# EAGLE schematic IceCore (EAGLE 7.7.0)
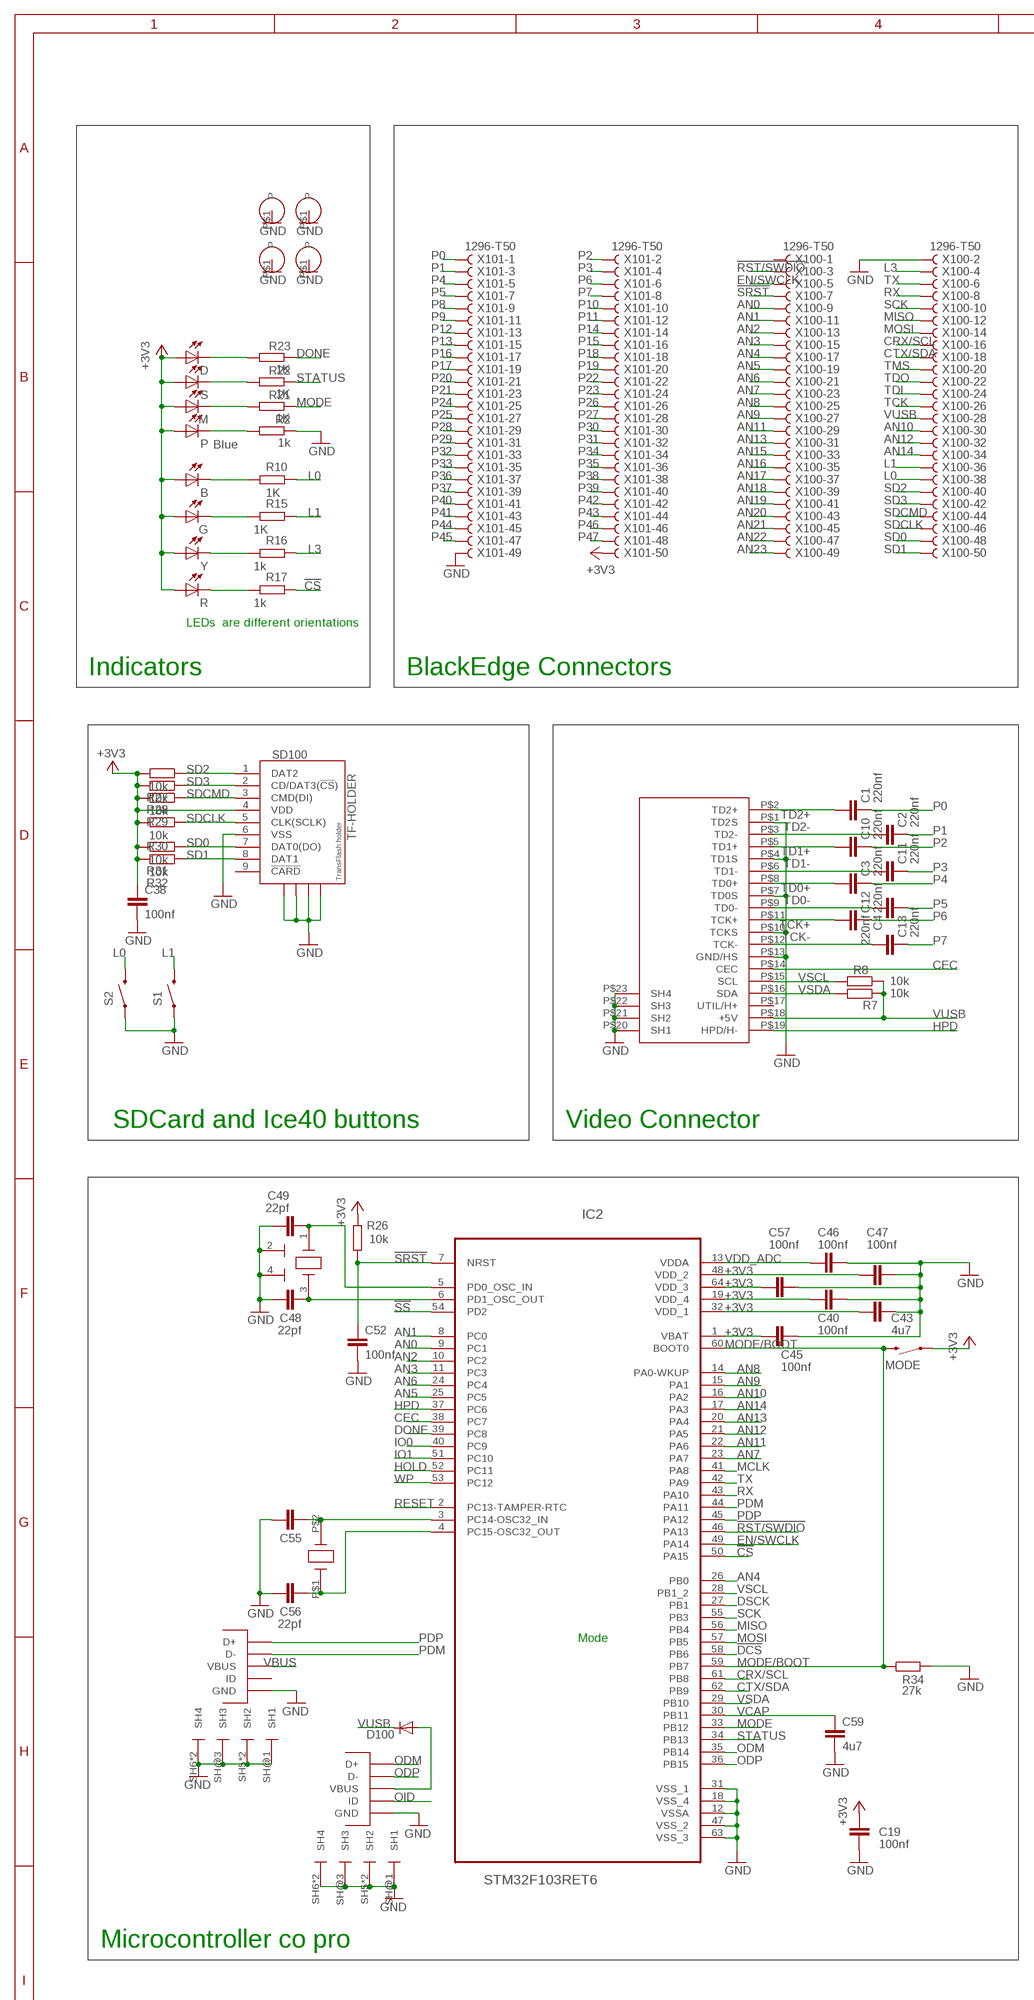
[diagram p0: schematic, sheet 1, part 1 of 2]
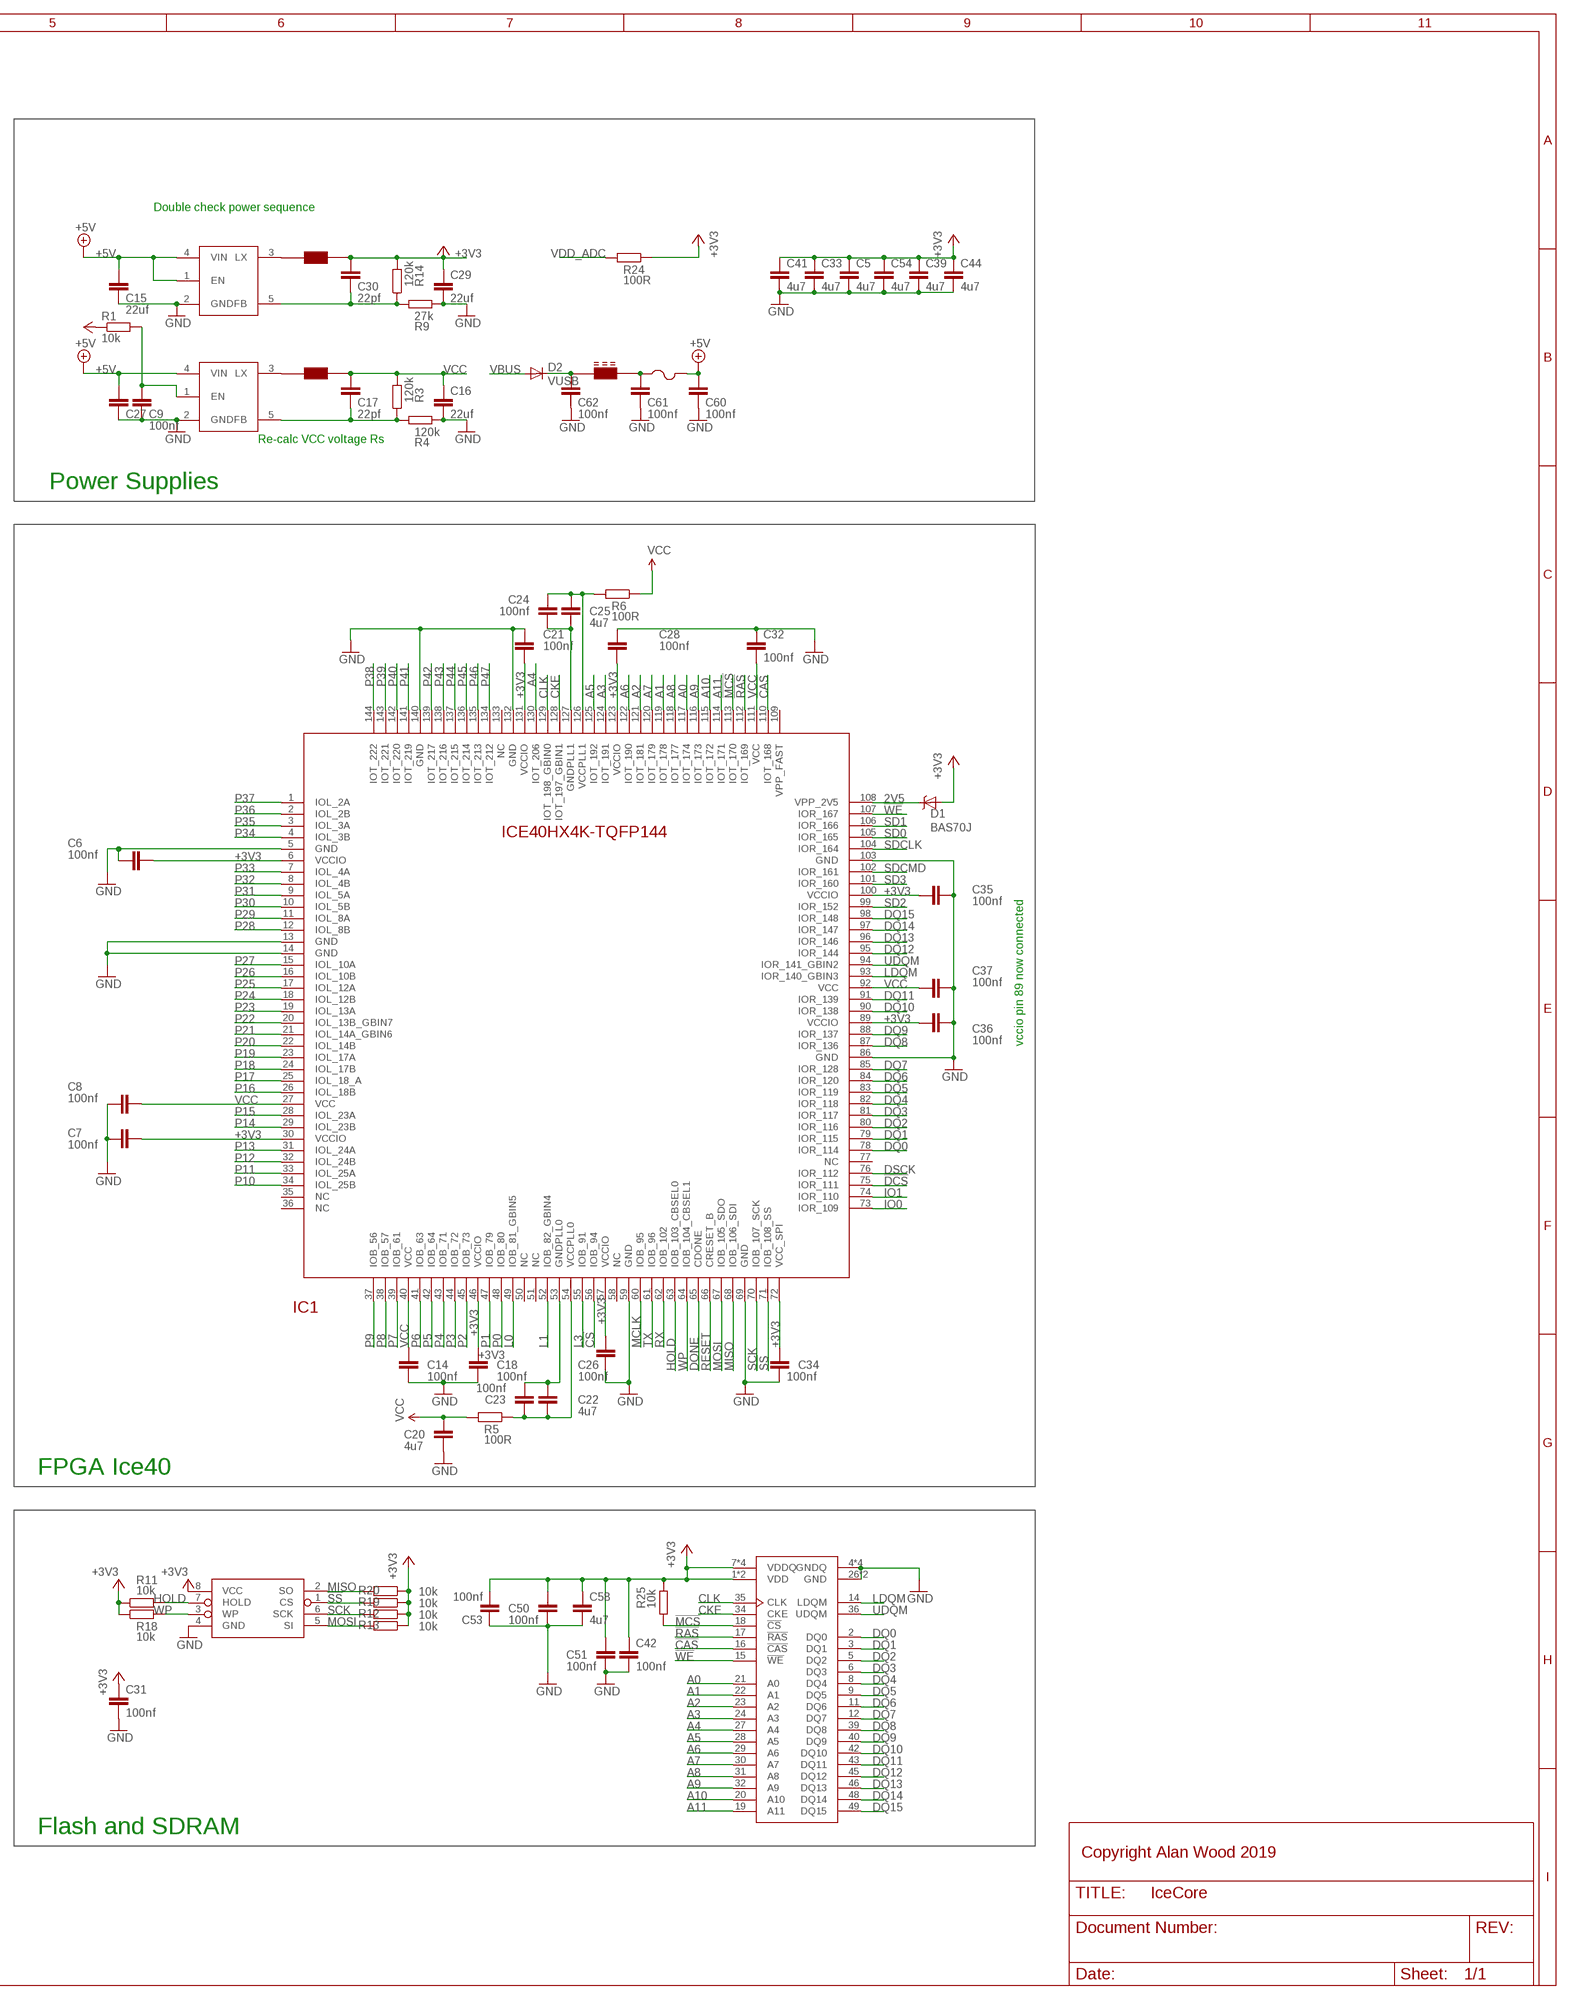
[diagram p1: schematic, sheet 1, part 2 of 2]

## Parts
B  LEDCHIPLED_0603  [CHIPLED_0603]
C1  220nf  C-EUC0402  [C0402]
C2  220nf  C-EUC0402  [C0402]
C3  220nf  C-EUC0402  [C0402]
C4  220nf  C-EUC0402  [C0402]
C5  4u7  C-EUC0402  [C0402]
C6  100nf  C-EUC0402  [C0402]
C7  100nf  C-EUC0402  [C0402]
C8  100nf  C-EUC0402  [C0402]
C9  100nf  C-EUC0402  [C0402]
C10  220nf  C-EUC0402  [C0402]
C11  220nf  C-EUC0402  [C0402]
C12  220nf  C-EUC0402  [C0402]
C13  220nf  C-EUC0402  [C0402]
C14  100nf  C-EUC0402  [C0402]
C15  22uf  C-EUC0603  [C0603]
C16  22uf  C-EUC0603  [C0603]
C17  22pf  C-EUC0402  [C0402]
C18  100nf  C-EUC0402  [C0402]
C19  100nf  C-EUC0402  [C0402]
C20  4u7  C-EUC0402  [C0402]
C21  100nf  C-EUC0402  [C0402]
C22  4u7  C-EUC0402  [C0402]
C23  100nf  C-EUC0402  [C0402]
C24  100nf  C-EUC0402  [C0402]
C25  4u7  C-EUC0402  [C0402]
C26  100nf  C-EUC0402  [C0402]
C27  22uf  C-EUC0603  [C0603]
C28  100nf  C-EUC0402  [C0402]
C29  22uf  C-EUC0603  [C0603]
C30  22pf  C-EUC0402  [C0402]
C31  100nf  C-EUC0402  [C0402]
C32  100nf  C-EUC0402  [C0402]
C33  4u7  C-EUC0402  [C0402]
C34  100nf  C-EUC0402  [C0402]
C35  100nf  C-EUC0402  [C0402]
C36  100nf  C-EUC0402  [C0402]
C37  100nf  C-EUC0402  [C0402]
C38  100nf  C-EUC0402  [C0402]
C39  4u7  C-EUC0402  [C0402]
C40  100nf  C-EUC0402  [C0402]
C41  4u7  C-EUC0402  [C0402]
C42  100nf  C-EUC0402  [C0402]
C43  4u7  C-EUC0402  [C0402]
C44  4u7  C-EUC0402  [C0402]
C45  100nf  C-EUC0402  [C0402]
C46  100nf  C-EUC0402  [C0402]
C47  100nf  C-EUC0402  [C0402]
C48  22pf  C-EUC0402  [C0402]
C49  22pf  C-EUC0402  [C0402]
C50  100nf  C-EUC0402  [C0402]
C51  100nf  C-EUC0402  [C0402]
C52  100nf  C-EUC0402  [C0402]
C53  100nf  C-EUC0402  [C0402]
C54  4u7  C-EUC0402  [C0402]
C55  22pf  C-EUC0402  [C0402]
C56  22pf  C-EUC0402  [C0402]
C57  100nf  C-EUC0402  [C0402]
C58  4u7  C-EUC0402  [C0402]
C59  4u7  C-EUC0402  [C0402]
C60  100nf  C-EUC0402  [C0402]
C61  100nf  C-EUC0402  [C0402]
C62  100nf  C-EUC0402  [C0402]
COM  FCI-MICROUSB-B-PEG  [MICROUSB-B-PEG]
D  LEDCHIPLED_0603  [CHIPLED_0603]
D1  BAS70J  [SOD-323]
D2  DIODE-SOD123  [SOD123]
D100  DIODE-SOD123  [SOD123]
F1  PTCFUSE-1206  [R1206]
FB1  FERRITE_BEAD  [0603]
G  LEDCHIPLED_0603  [CHIPLED_0603]
IC1  ICE40HX4K_TQFP144  [TQFP144]
IC2  STM32F103RET6  [QFP50P1200X1200X160-64N]
IC3  SDRAM  [TSOP-2-50]
M  LEDCHIPLED_0603  [CHIPLED_0603]
MODE  SWITCH-MOMENTARY-2SMD-1101NE  [TACTILE-SWITCH-1101NE]
P  Blue  LEDCHIPLED_0603  [CHIPLED_0603]
R  LEDCHIPLED_0603  [CHIPLED_0603]
R1  10k  R-EU_R0402  [R0402]
R2  1k  R-EU_R0402  [R0402]
R3  120k  R-EU_R0402  [R0402]
R4  120k  R-EU_R0402  [R0402]
R5  100R  R-EU_R0402  [R0402]
R6  100R  R-EU_R0402  [R0402]
R7  10k  R-EU_R0402  [R0402]
R8  10k  R-EU_R0402  [R0402]
R9  27k  R-EU_R0402  [R0402]
R10  1K  R-EU_R0402  [R0402]
R11  10k  R-EU_R0402  [R0402]
R12  10k  R-EU_R0402  [R0402]
R13  10k  R-EU_R0402  [R0402]
R14  120k  R-EU_R0402  [R0402]
R15  1K  R-EU_R0402  [R0402]
R16  1k  R-EU_R0402  [R0402]
R17  1k  R-EU_R0402  [R0402]
R18  10k  R-EU_R0402  [R0402]
R19  10k  R-EU_R0402  [R0402]
R20  10k  R-EU_R0402  [R0402]
R21  1K  R-EU_R0402  [R0402]
R22  1K  R-EU_R0402  [R0402]
R23  1K  R-EU_R0402  [R0402]
R24  100R  R-EU_R0402  [R0402]
R25  10k  R-EU_R0402  [R0402]
R26  10k  R-EU_R0402  [R0402]
R27  10k  R-EU_R0402  [R0402]
R28  10k  R-EU_R0402  [R0402]
R29  10k  R-EU_R0402  [R0402]
R30  10k  R-EU_R0402  [R0402]
R31  10k  R-EU_R0402  [R0402]
R32  10k  R-EU_R0402  [R0402]
R34  27k  R-EU_R0402  [R0402]
S  LEDCHIPLED_0603  [CHIPLED_0603]
S1  SWITCH-MOMENTARY-2SMD-1101NE  [TACTILE-SWITCH-1101NE]
S2  SWITCH-MOMENTARY-2SMD-1101NE  [TACTILE-SWITCH-1101NE]
SD100  TF-HOLDER  [TF-PULL]
U$1  HOLE-2.5MM  [2.5MM-HOLE]
U$2  HOLE-2.5MM  [2.5MM-HOLE]
U$3  AP3429/A  [TSOP-5/SOT23-5]
U$4  NRS4018  [NRC4018]
U$5  HD10-001_HDMIMINI-HDMI  [MINI-HDMI]
U$6  AP3429/A  [TSOP-5/SOT23-5]
U$7  NRS4018  [NRC4018]
U$8  AT25SDF041A  [SOIC-8-NARROW]
U$10  FCI-MICROUSB-B-PEG  [MICROUSB-B-PEG]
U$11  FC-135  [FC135]
U$12  HOLE-2.5MM  [2.5MM-HOLE]
U$13  HOLE-2.5MM  [2.5MM-HOLE]
X100  1296-T50  [1296-50]
X101  1296-T50  [1296-50]
Y  LEDCHIPLED_0603  [CHIPLED_0603]
Y1  12MZ  7M-25  [CRYSTAL-3.2X2.5]

## Nets
2V5: D1.C IC1.108(VPP_2V5)
!CAS: IC1.110(IOT_168) IC3.16(!CAS)
!CS: IC1.56(IOB_94) IC2.50(PA15) R17.2
!DCS: IC1.75(IOR_111) IC2.58(PB6)
!MCS: IC1.113(IOT_170) IC3.18(!CS) R25.1
!RAS: IC1.112(IOT_169) IC3.17(!RAS)
!RST/SWDIO: IC2.46(PA13) X100.3
!SRST: C52.1 IC2.7(NRST) R26.1 X100.7
!SS: IC1.71(IOB_108_SS) IC2.54(PD2) R19.2 U$8.1(CS)
!WE: IC1.107(IOR_167) IC3.15(!WE)
+3V3: B.A C5.1 C6.1 C7.2 C18.1 C19.1 C21.1 C26.1 C28.2 C29.1 C30.2 C31.1 C33.1 C34.1 C35.1 C36.1 C38.1 C39.1 C40.2 C41.1 C42.1 C43.2 C44.1 C45.2 C47.2 C50.1 C51.1 C53.2 C54.1 C57.2 C58.1 D1.A D.A G.A IC1.6(VCCIO) IC1.30(VCCIO) IC1.46(VCCIO) IC1.57(VCCIO) IC1.72(VCC_SPI) IC1.89(VCCIO) IC1.100(VCCIO) IC1.123(VCCIO) IC1.131(VCCIO) IC2.1(VBAT) IC2.19(VDD_4) IC2.32(VDD_1) IC2.48(VDD_2) IC2.64(VDD_3) IC3.1(VDD) IC3.7(VDDQ) IC3.13(VDDQ) IC3.25(VDD) IC3.38(VDDQ) IC3.44(VDDQ) M.A MODE.1 P.A R1.1 R11.1 R12.1 R13.1 R14.2 R18.1 R19.1 R20.1 R24.1 R25.2 R26.2 R27.2 R28.2 R29.2 R30.2 R31.2 R32.2 R.A S.A SD100.4(VDD) U$7.P$2 U$8.8(VCC) X101.50 Y.A
+5V: C15.2 C27.2 C60.2 F1.2 U$3.4(VIN) U$6.1(EN) U$6.4(VIN)
A0: IC1.117(IOT_174) IC3.21(A0)
A1: IC1.119(IOT_178) IC3.22(A1)
A2: IC1.121(IOT_181) IC3.23(A2)
A3: IC1.124(IOT_191) IC3.24(A3)
A4: IC1.130(IOT_206) IC3.27(A4)
A5: IC1.125(IOT_192) IC3.28(A5)
A6: IC1.122(IOT_190) IC3.29(A6)
A7: IC1.120(IOT_179) IC3.30(A7)
A8: IC1.118(IOT_177) IC3.31(A8)
A9: IC1.116(IOT_173) IC3.32(A9)
A10: IC1.115(IOT_172) IC3.20(A10)
A11: IC1.114(IOT_171) IC3.19(A11)
AN0: IC2.9(PC1) X100.9
AN1: IC2.8(PC0) X100.11
AN2: IC2.10(PC2) X100.13
AN3: IC2.11(PC3) X100.15
AN4: IC2.26(PB0) X100.17
AN5: IC2.25(PC5) X100.19
AN6: IC2.24(PC4) X100.21
AN7: IC2.23(PA7) X100.23
AN8: IC2.14(PA0-WKUP) X100.25
AN9: IC2.15(PA1) X100.27
AN10: IC2.16(PA2) X100.30
AN11: IC2.22(PA6) X100.29
AN12: IC2.21(PA5) X100.32
AN13: IC2.20(PA4) X100.31
AN14: IC2.17(PA3) X100.34
AN15: X100.33
AN16: X100.35
AN17: X100.37
AN18: X100.39
AN19: X100.41
AN20: X100.43
AN21: X100.45
AN22: X100.47
AN23: X100.49
CEC: IC2.38(PC7) U$5.P$14(CEC)
CKE: IC1.128(IOT_197_GBIN1) IC3.34(CKE)
CLK: IC1.129(IOT_198_GBIN0) IC3.35(CLK)
CRX/SCL: IC2.61(PB8) X100.16
CTX/SDA: IC2.62(PB9) X100.18
DONE: IC1.65(CDONE) IC2.39(PC8) R23.1
DQ0: IC1.78(IOR_114) IC3.2(DQ0)
DQ1: IC1.79(IOR_115) IC3.3(DQ1)
DQ2: IC1.80(IOR_116) IC3.5(DQ2)
DQ3: IC1.81(IOR_117) IC3.6(DQ3)
DQ4: IC1.82(IOR_118) IC3.8(DQ4)
DQ5: IC1.83(IOR_119) IC3.9(DQ5)
DQ6: IC1.84(IOR_120) IC3.11(DQ6)
DQ7: IC1.85(IOR_128) IC3.12(DQ7)
DQ8: IC1.87(IOR_136) IC3.39(DQ8)
DQ9: IC1.88(IOR_137) IC3.40(DQ9)
DQ10: IC1.90(IOR_138) IC3.42(DQ10)
DQ11: IC1.91(IOR_139) IC3.43(DQ11)
DQ12: IC1.95(IOR_144) IC3.45(DQ12)
DQ13: IC1.96(IOR_146) IC3.46(DQ13)
DQ14: IC1.97(IOR_147) IC3.48(DQ14)
DQ15: IC1.98(IOR_148) IC3.49(DQ15)
DSCK: IC1.76(IOR_112) IC2.27(PB1)
EN/SWCLK: IC2.49(PA14) X100.5
GND: C5.2 C6.2 C7.1 C8.2 C9.1 C14.2 C15.1 C16.2 C18.2 C19.2 C20.2 C21.2 C26.2 C27.1 C28.1 C29.2 C31.2 C32.1 C33.2 C34.2 C35.2 C36.2 C37.2 C38.2 C39.2 C40.1 C41.2 C42.2 C43.1 C44.2 C45.1 C46.1 C47.1 C48.1 C49.1 C50.2 C51.2 C52.2 C53.1 C54.2 C55.1 C56.1 C57.1 C58.2 C59.2 C60.1 C61.1 C62.1 COM.P$5(GND) COM.SH5(SH2) COM.SH6(SH4) COM.SH@1(SH1) COM.SH@2(SH2) COM.SH@3(SH3) COM.SH@4(SH4) IC1.5(GND) IC1.13(GND) IC1.14(GND) IC1.59(GND) IC1.69(GND) IC1.86(GND) IC1.103(GND) IC1.132(GND) IC1.140(GND) IC2.12(VSSA) IC2.18(VSS_4) IC2.31(VSS_1) IC2.47(VSS_2) IC2.63(VSS_3) IC3.4(GNDQ) IC3.10(GNDQ) IC3.26(GND) IC3.41(GNDQ) IC3.47(GNDQ) IC3.50(GND) R2.1 R4.2 R9.2 R34.2 S1.1 S2.1 SD100.6(VSS) SD100.S1 SD100.S2 SD100.S3 SD100.S4 U$1.P$1(P) U$2.P$1(P) U$3.2(GND) U$5.P$1(TD2S) U$5.P$4(TD1S) U$5.P$7(TD0S) U$5.P$10(TCKS) U$5.P$13(GND/HS) U$5.P$20(SH1) U$5.P$21(SH2) U$5.P$22(SH3) U$5.P$23(SH4) U$6.2(GND) U$8.4(GND) U$10.P$5(GND) U$10.SH5(SH2) U$10.SH6(SH4) U$10.SH@1(SH1) U$10.SH@2(SH2) U$10.SH@3(SH3) U$10.SH@4(SH4) U$12.P$1(P) U$13.P$1(P) X100.2 X101.49 Y1.2(GND) Y1.4(GND)
HOLD: IC1.63(IOB_103_CBSEL0) IC2.52(PC11) R11.2 U$8.7(HOLD)
HPD: IC2.37(PC6) U$5.P$19(HPD/H-)
IO0: IC1.73(IOR_109) IC2.40(PC9)
IO1: IC1.74(IOR_110) IC2.51(PC10)
L0: IC1.49(IOB_81_GBIN5) R10.2 S2.2 X100.38
L1: IC1.52(IOB_82_GBIN4) R15.2 S1.2 X100.36
L3: IC1.55(IOB_91) R16.2 X100.4
LDQM: IC1.93(IOR_140_GBIN3) IC3.14(LDQM)
MCLK: IC1.60(IOB_95) IC2.41(PA8)
MISO: IC1.68(IOB_106_SDI) IC2.56(PB4) R20.2 U$8.2(SO) X100.12
MODE: IC2.33(PB12) R21.1
MODE/BOOT: IC2.59(PB7) IC2.60(BOOT0) MODE.2 R34.1
MOSI: IC1.67(IOB_105_SDO) IC2.57(PB5) R13.2 U$8.5(SI) X100.14
N$1: P.C R2.2
N$2: R22.2 S.C
N$3: C24.2 C25.2 IC1.126(VCCPLL1) R6.2
N$4: M.C R21.2
N$5: C56.2 IC2.4(PC15-OSC32_OUT) U$11.P$1(X1)
N$6: C22.1 C23.2 IC1.53(GNDPLL0)
N$7: C48.2 IC2.6(PD1_OSC_OUT) Y1.3(X2)
N$8: C9.2 R1.2 U$3.1(EN)
N$9: B.C R10.1
N$10: C55.2 IC2.3(PC14-OSC32_IN) U$11.P$2(X2)
N$11: G.C R15.1
N$12: R16.1 Y.C
N$13: COM.P$1(VBUS) D100.A
N$14: C24.1 C25.1 IC1.127(GNDPLL1)
N$15: R17.1 R.C
N$16: C61.2 F1.1 FB1.2
N$18: C22.2 C23.1 IC1.54(VCCPLL0) R5.1
N$19: C49.2 IC2.5(PD0_OSC_IN) Y1.1(X1)
N$22: D.C R23.2
N$56: U$3.3(LX) U$4.P$1
N$91: C17.1 R3.1 R4.1 U$3.5(FB)
N$93: C30.1 R9.1 R14.1 U$6.5(FB)
N$94: U$6.3(LX) U$7.P$1
ODM: COM.P$3(D+) IC2.35(PB14)
ODP: COM.P$2(D-) IC2.36(PB15)
OID: COM.P$4(ID)
P0: C1.1 IC1.48(IOB_80) X101.1
P1: C2.1 IC1.47(IOB_79) X101.3
P2: C10.1 IC1.45(IOB_73) X101.2
P3: C11.1 IC1.44(IOB_72) X101.4
P4: C3.1 IC1.43(IOB_71) X101.5
P5: C4.2 IC1.42(IOB_64) X101.7
P6: C12.1 IC1.41(IOB_63) X101.6
P7: C13.1 IC1.39(IOB_61) X101.8
P8: IC1.38(IOB_57) X101.9
P9: IC1.37(IOB_56) X101.11
P10: IC1.34(IOL_25B) X101.10
P11: IC1.33(IOL_25A) X101.12
P12: IC1.32(IOL_24B) X101.13
P13: IC1.31(IOL_24A) X101.15
P14: IC1.29(IOL_23B) X101.14
P15: IC1.28(IOL_23A) X101.16
P16: IC1.26(IOL_18B) X101.17
P17: IC1.25(IOL_18_A) X101.19
P18: IC1.24(IOL_17B) X101.18
P19: IC1.23(IOL_17A) X101.20
P20: IC1.22(IOL_14B) X101.21
P21: IC1.21(IOL_14A_GBIN6) X101.23
P22: IC1.20(IOL_13B_GBIN7) X101.22
P23: IC1.19(IOL_13A) X101.24
P24: IC1.18(IOL_12B) X101.25
P25: IC1.17(IOL_12A) X101.27
P26: IC1.16(IOL_10B) X101.26
P27: IC1.15(IOL_10A) X101.28
P28: IC1.12(IOL_8B) X101.29
P29: IC1.11(IOL_8A) X101.31
P30: IC1.10(IOL_5B) X101.30
P31: IC1.9(IOL_5A) X101.32
P32: IC1.8(IOL_4B) X101.33
P33: IC1.7(IOL_4A) X101.35
P34: IC1.4(IOL_3B) X101.34
P35: IC1.3(IOL_3A) X101.36
P36: IC1.2(IOL_2B) X101.37
P37: IC1.1(IOL_2A) X101.39
P38: IC1.144(IOT_222) X101.38
P39: IC1.143(IOT_221) X101.40
P40: IC1.142(IOT_220) X101.41
P41: IC1.141(IOT_219) X101.43
P42: IC1.139(IOT_217) X101.42
P43: IC1.138(IOT_216) X101.44
P44: IC1.137(IOT_215) X101.45
P45: IC1.136(IOT_214) X101.47
P46: IC1.135(IOT_213) X101.46
P47: IC1.134(IOT_212) X101.48
PDM: IC2.44(PA11) U$10.P$2(D-)
PDP: IC2.45(PA12) U$10.P$3(D+)
RESET: IC1.66(CRESET_B) IC2.2(PC13-TAMPER-RTC)
RX: IC1.62(IOB_102) IC2.43(PA10) X100.8
SCK: IC1.70(IOB_107_SCK) IC2.55(PB3) R12.2 U$8.6(SCK) X100.10
SD0: IC1.105(IOR_165) R31.1 SD100.7(DAT0(DO)) X100.48
SD1: IC1.106(IOR_166) R32.1 SD100.8(DAT1) X100.50
SD2: IC1.99(IOR_152) R27.1 SD100.1(DAT2) X100.40
SD3: IC1.101(IOR_160) R28.1 SD100.2(CD/DAT3(!CS!)) X100.42
SDCLK: IC1.104(IOR_164) R30.1 SD100.5(CLK(SCLK)) X100.46
SDCMD: IC1.102(IOR_161) R29.1 SD100.3(CMD(DI)) X100.44
STATUS: IC2.34(PB13) R22.1
TCK: X100.26
TCK+: C12.2 U$5.P$11(TCK+)
TCK-: C13.2 U$5.P$12(TCK-)
TD0+: C3.2 U$5.P$8(TD0+)
TD0-: C4.1 U$5.P$9(TD0-)
TD1+: C10.2 U$5.P$5(TD1+)
TD1-: C11.2 U$5.P$6(TD1-)
TD2+: C1.2 U$5.P$2(TD2+)
TD2-: C2.2 U$5.P$3(TD2-)
TDI: X100.24
TDO: X100.22
TMS: X100.20
TX: IC1.61(IOB_96) IC2.42(PA9) X100.6
UDQM: IC1.94(IOR_141_GBIN2) IC3.36(UDQM)
VBUS: D2.A U$10.P$1(VBUS)
VCAP: C59.1 IC2.30(PB11)
VCC: C8.1 C14.1 C16.1 C17.2 C20.1 C32.2 C37.1 IC1.27(VCC) IC1.40(VCC) IC1.92(VCC) IC1.111(VCC) R3.2 R5.2 R6.1 U$4.P$2
VDD_ADC: C46.2 IC2.13(VDDA) R24.2
VSCL: IC2.28(PB1_2) R8.2 U$5.P$15(SCL)
VSDA: IC2.29(PB10) R7.2 U$5.P$16(SDA)
VUSB: C62.2 D2.C D100.C FB1.1 R7.1 R8.1 U$5.P$18(+5V) X100.28
WP: IC1.64(IOB_104_CBSEL1) IC2.53(PC12) R18.2 U$8.3(WP)
Unconnected: IC1.35(NC) IC1.36(NC) IC1.50(NC) IC1.51(NC) IC1.58(NC) IC1.77(NC) IC1.109(VPP_FAST) IC1.133(NC) IC3.33(NC) IC3.37(NC) SD100.9(!CARD) U$5.P$17(UTIL/H+) U$10.P$4(ID) X100.1

## Notes on the sheet
- Double check power sequence
- Re-calc VCC voltage Rs
- Power Supplies
- LEDs  are different orientations
- Indicators | BlackEdge Connectors
- vccio pin 89 now connected
- SDCard and Ice40 buttons | Video Connector
- FPGA Ice40
- Mode
- Flash and SDRAM
- Microcontroller co pro
- Copyright Alan Wood 2019

## Library data of the parts
B D G M P R S Y = led:LED: LED OSRAM: - CHIPLED LG R971, LG N971, LY N971, LG Q971, LY Q971, LO R971, LY R971 LH N974, LH R974 LS Q976, LO Q976, LY Q976 LO Q996 - Hyper CHIPLED LW Q18S LB Q993, LB Q99A, LB R99A - SideLED LS A670, LO A670, LY A670, LG A670, LP A670 LB A673, LV A673, LT A673, LW A673 LH A674 LY A675 LS A676, LA A676, LO A676, LY A676, LW A676 LS A679, LY A679, LG A679 - Hyper Micro SIDELED® LS Y876, LA Y876, LO Y876, LY Y876 LT Y87S - SmartLED LW L88C, LW L88S LB L89C, LB L89S, LG L890 LS L89K, LO L89K, LY L89K LS L896, LA L896, LO L896, LY L896 - TOPLED LS T670, LO T670, LY T670, LG T670, LP T670 LSG T670, LSP T670, LSY T670, LOP T670, LYG T670 LG T671, LOG T671, LSG T671 LB T673, LV T673, LT T673, LW T673 LH T674 LS T676, LA T676, LO T676, LY T676, LB T676, LH T676, LSB T676, LW T676 LB T67C, LV T67C, LT T67C, LS T67K, LO T67K, LY T67K, LW E67C LS E67B, LA E67B, LO E67B, LY E67B, LB E67C, LV E67C, LT E67C LW T67C LS T679, LY T679, LG T679 LS T770, LO T770, LY T770, LG T770, LP T770 LB T773, LV T773, LT T773, LW T773 LH T774 LS E675, LA E675, LY E675, LS T675 LS T776, LA T776, LO T776, LY T776, LB T776 LHGB T686 LT T68C, LB T68C - Hyper Mini TOPLED® LB M676 - Mini TOPLED Santana® LG M470 LS M47K, LO M47K, LY M47K Source: http://www.osram.convergy.de LUXEON: - LUMILED® LXK2-PW12-R00, LXK2-PW12-S00, LXK2-PW14-U00, LXK2-PW14-V00 LXK2-PM12-R00, LXK2-PM12-S00, LXK2-PM14-U00 LXK2-PE12-Q00, LXK2-PE12-R00, LXK2-PE12-S00, LXK2-PE14-T00, LXK2-PE14-U00 LXK2-PB12-K00, LXK2-PB12-L00, LXK2-PB12-M00, LXK2-PB14-N00, LXK2-PB14-P00, LXK2-PB14-Q00 LXK2-PR12-L00, LXK2-PR12-M00, LXK2-PR14-Q00, LXK2-PR14-R00 LXK2-PD12-Q00, LXK2-PD12-R00, LXK2-PD12-S00 LXK2-PH12-R00, LXK2-PH12-S00 LXK2-PL12-P00, LXK2-PL12-Q00, LXK2-PL12-R00 Source: www.luxeon.com KINGBRIGHT: KA-3528ASYC Source: www.kingbright.com
C1-C62 = rcl:C-EU: CAPACITOR, European symbol
COM U$10 = amino:FCI-MICROUSB-B-PEG
D1 = ELL-i-DiscreteSemi:BAS70: Silicon Schottky Diodes General-purpose diode for high-speed switching. Maximum forward current 70 mA Maxiumum forward voltage drop Vf 0.410 mV Maximum reverse voltage 70V
D2 D100 = diode:DIODE-: DIODE
F1 = PTCFUSE:PTCFUSE
FB1 = amino:FERRITE_BEAD
IC1 = ICE40:ICE40HX4K_TQFP144
IC2 = stm:STM32F103RET6: ARM-based 32-bit MCU; MPN: STM32F103RET6; OC_FARNELL: 1624138; OC_NEWARK: 01P4101; PACKAGE: QFP-64; SUPPLIER: STMICROELECTRONICS
IC3 = amino:SDRAM
MODE S1 S2 = SparkFun-Electromechanical:SWITCH-MOMENTARY-2: Various NO switches- pushbuttons, reed, etc; PROD_ID: SWCH-00815
R1-R25 R27-R32 R34 = resistor:R-EU_: RESISTOR, European symbol
R26 = rcl:R-EU_: RESISTOR, European symbol
SD100 = sd-mmc:TF-HOLDER: TF / Micro SD socket is PUSH-PUSH type, the card can be pushed into and auto locked and pushed out by simply press the card. Surface Mounting type.
U$1 U$2 U$12 U$13 = amino:HOLE-2.5MM
U$3 U$6 = amino:AP3429/A
U$4 U$7 = amino:NRS4018
U$5 = amino:HD10-001_HDMI
U$8 = amino:AT25SDF041A
U$11 = amino:FC-135
X100 X101 = con-leotronics:1296-T50: 1.27mm SINGLE ROW FEMALE SOCKET Source: http://www.leotronics.co.uk/Conexcon/Data%20Sheets/sec.%20A/1296ing.pdf; OC_FARNELL: unknown; OC_NEWARK: unknown
Y1 = amino:7M-25

## Net classes
2 thin_power: width 0.254 mm